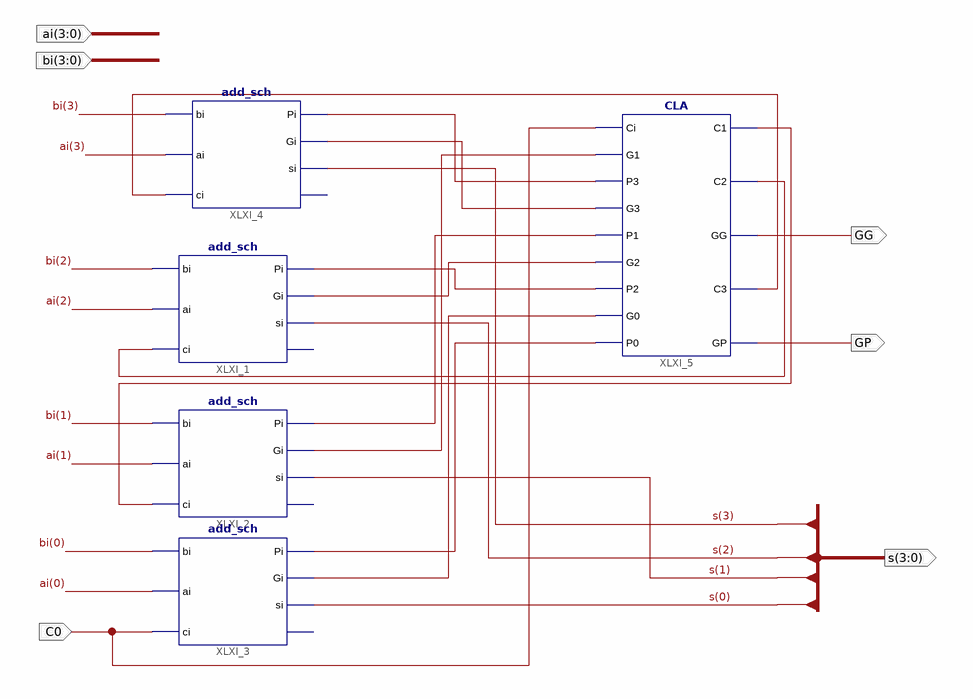
[diagram p0: schematic sheet 1]
// Xilinx ISE schematic add4b.sch (kintex7) as structural Verilog: 5 symbols, 6 ports
module add4b (
  input  [3:0] ai,
  input  [3:0] bi,
  input  C0,
  output [3:0] s,
  output GG,
  output GP
);

  wire XLXN_25, XLXN_26, XLXN_27, XLXN_28, XLXN_29, XLXN_30, XLXN_31, XLXN_32, XLXN_33, XLXN_34, XLXN_35;

  add_sch XLXI_1 (.bi(bi[2]), .ai(ai[2]), .ci(XLXN_34), .Pi(XLXN_29), .Gi(XLXN_30), .si(s[2]));  // open: co
  add_sch XLXI_2 (.bi(bi[1]), .ai(ai[1]), .ci(XLXN_33), .Pi(XLXN_28), .Gi(XLXN_27), .si(s[1]));  // open: co
  add_sch XLXI_3 (.bi(bi[0]), .ai(ai[0]), .ci(C0), .Pi(XLXN_25), .Gi(XLXN_26), .si(s[0]));  // open: co
  add_sch XLXI_4 (.bi(bi[3]), .ai(ai[3]), .ci(XLXN_35), .Pi(XLXN_32), .Gi(XLXN_31), .si(s[3]));  // open: co
  CLA XLXI_5 (
    .Ci(C0), .G1(XLXN_27), .P3(XLXN_32), .G3(XLXN_31), .P1(XLXN_28), .G2(XLXN_30), .P2(XLXN_29),
    .G0(XLXN_26), .P0(XLXN_25), .C1(XLXN_33), .C2(XLXN_34), .GG(GG), .C3(XLXN_35), .GP(GP));
endmodule
